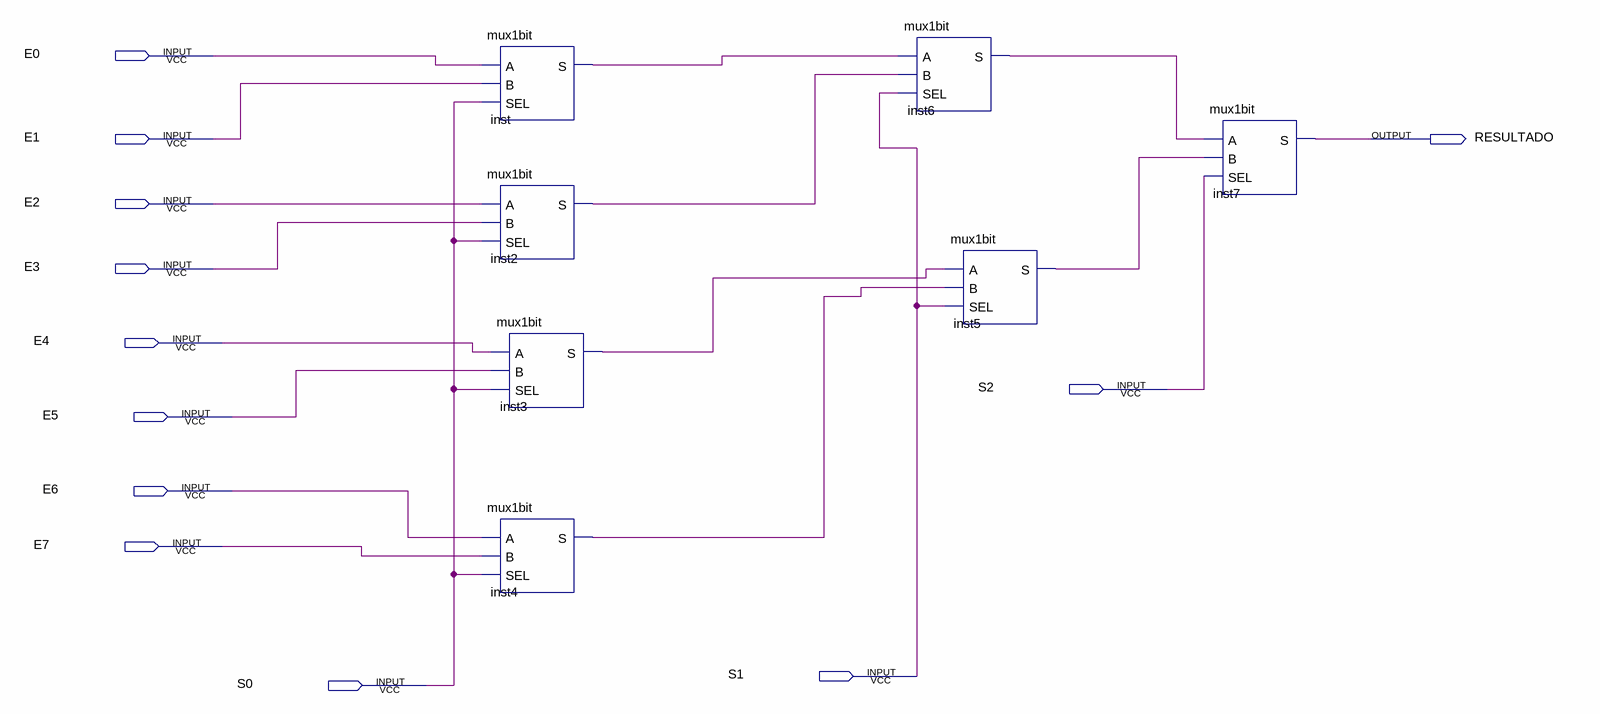
[diagram p0: schematic sheet]
// Quartus schematic bit1mux8x1.bdf as structural Verilog: 7 symbols, 12 pins
module bit1mux8x1 (
  input  E0,
  input  E1,
  input  E2,
  input  E3,
  input  E4,
  input  S2,
  input  E5,
  input  E6,
  input  E7,
  input  S1,
  input  S0,
  output RESULTADO
);

  wire inst2_s, inst3_s, inst4_s, inst5_s, inst6_s, inst_s;

  mux1bit inst (.A(E0), .B(E1), .SEL(S0), .S(inst_s));
  mux1bit inst2 (.A(E2), .B(E3), .SEL(S0), .S(inst2_s));
  mux1bit inst3 (.A(E4), .B(E5), .SEL(S0), .S(inst3_s));
  mux1bit inst4 (.A(E6), .B(E7), .SEL(S0), .S(inst4_s));
  mux1bit inst6 (.A(inst_s), .B(inst2_s), .SEL(S1), .S(inst6_s));
  mux1bit inst5 (.A(inst3_s), .B(inst4_s), .SEL(S1), .S(inst5_s));
  mux1bit inst7 (.A(inst6_s), .B(inst5_s), .SEL(S2), .S(RESULTADO));
endmodule
